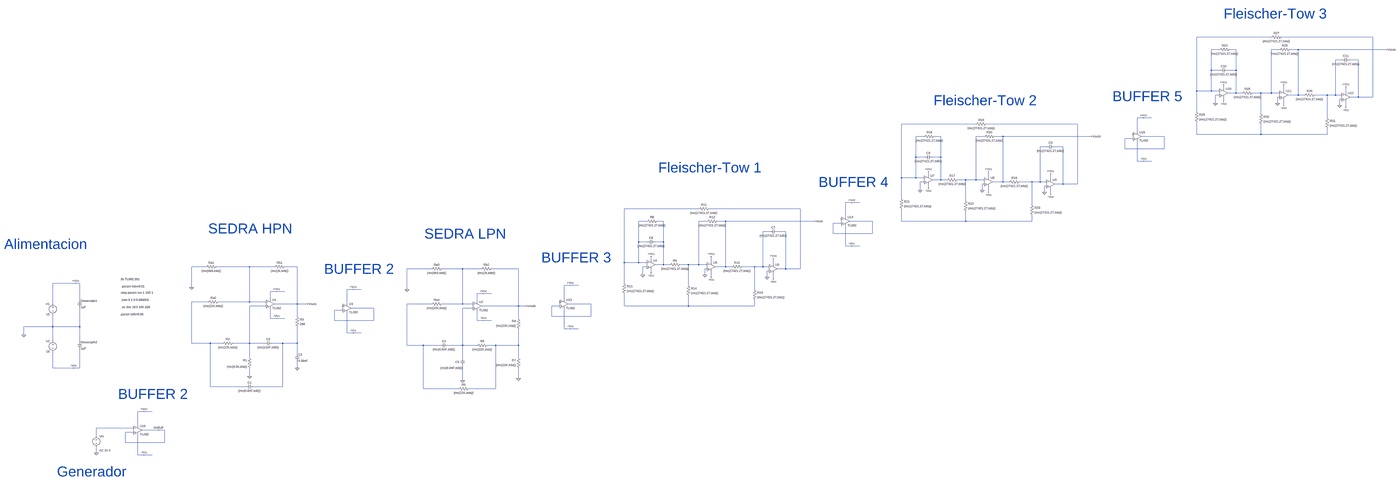
[diagram p0: schematic Filtro final.asc, whole sheet]
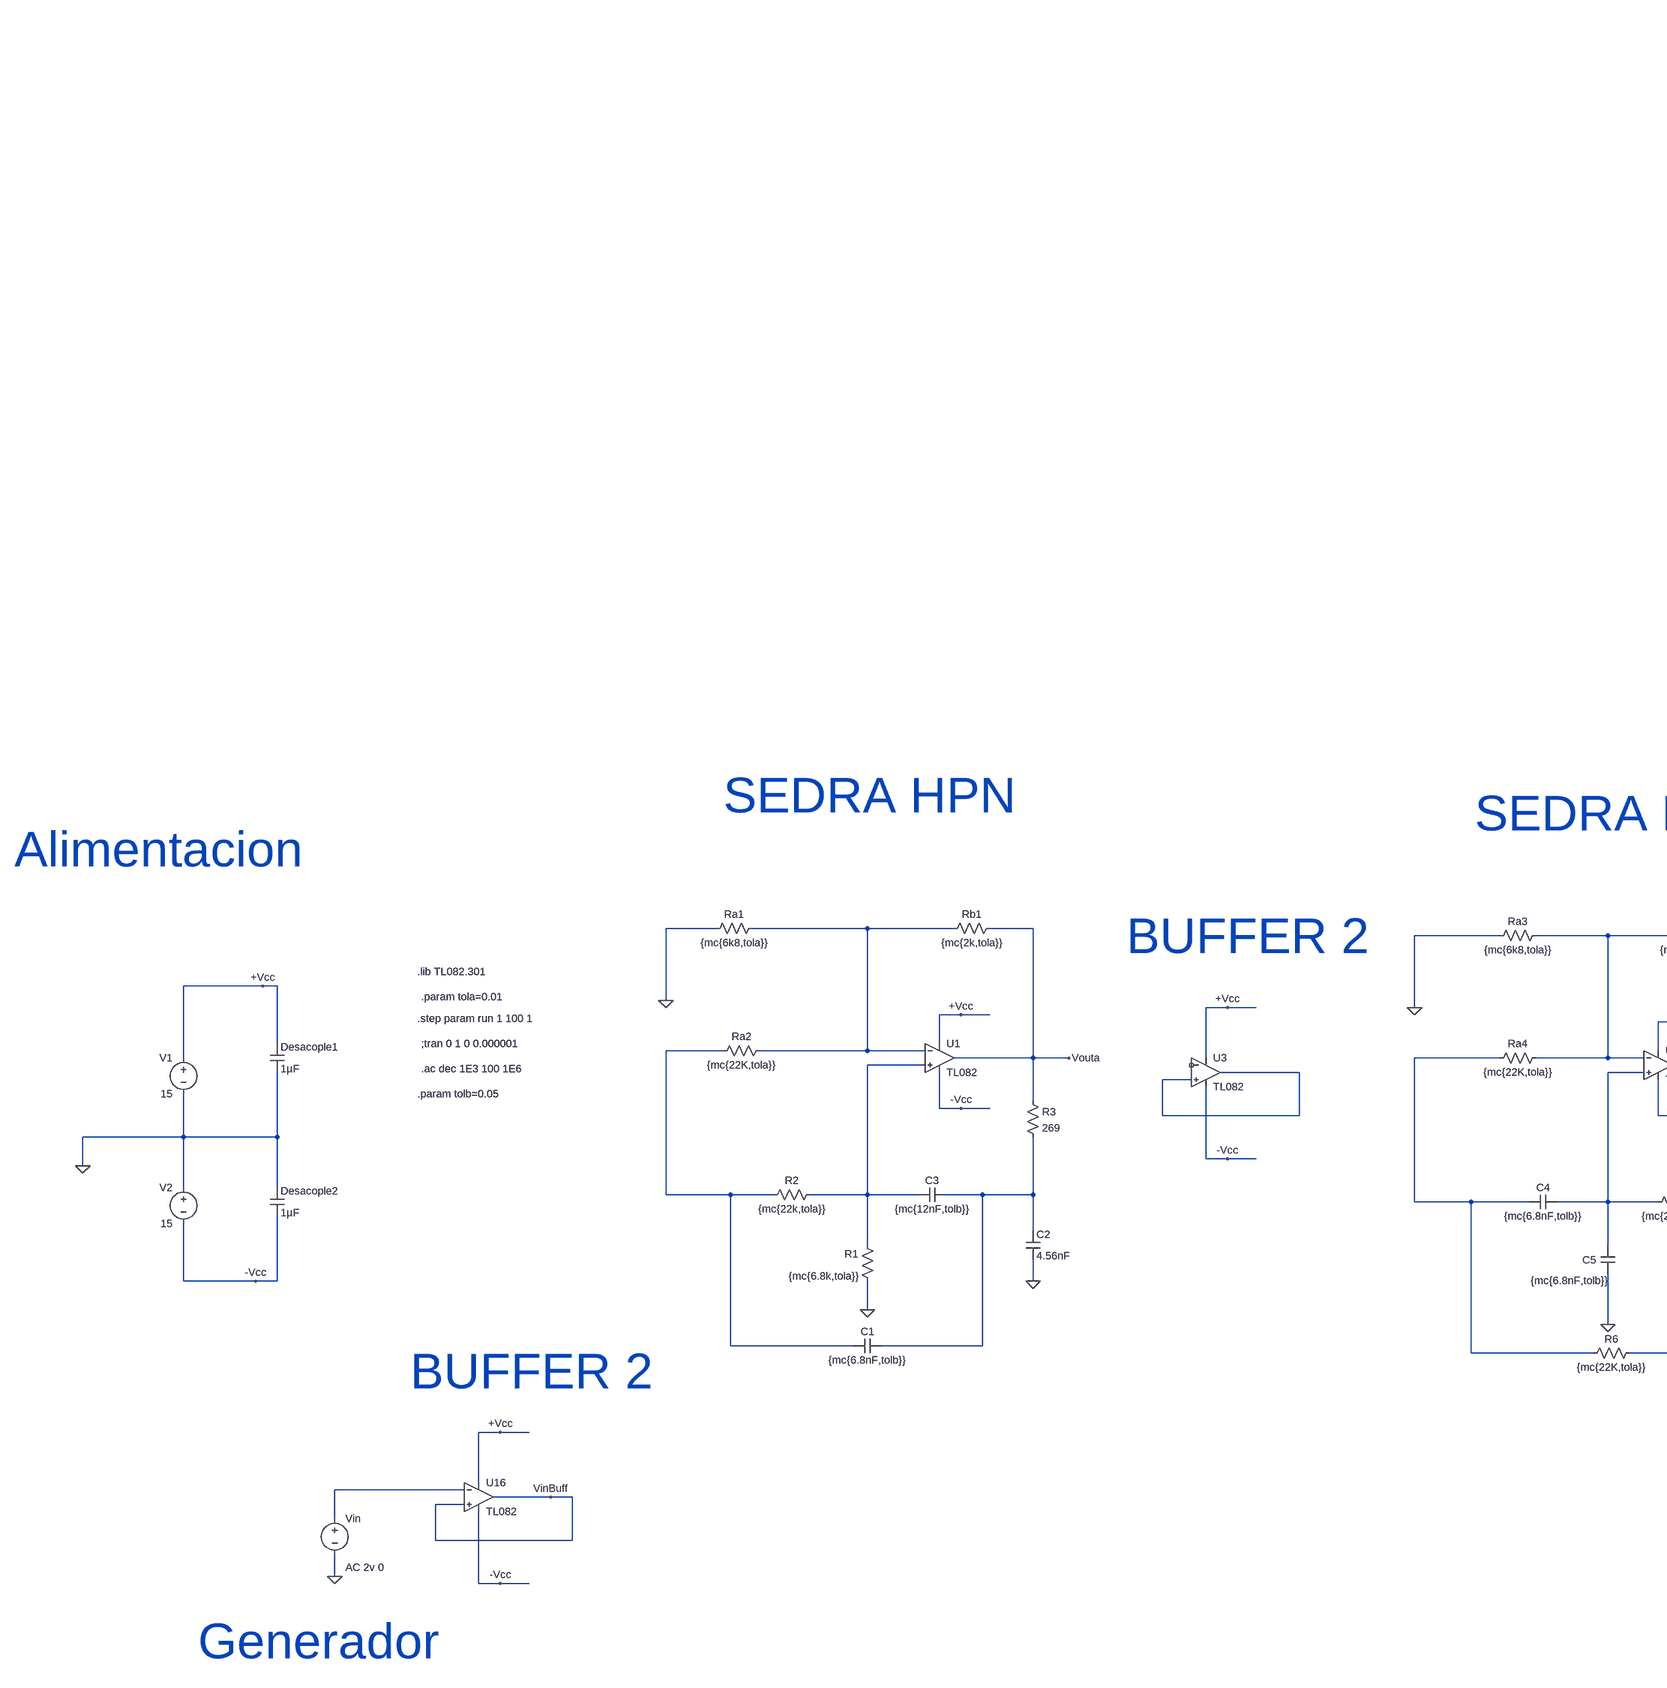
[diagram p1: schematic Filtro final.asc, part, row 1 of 1, column 1 of 3]
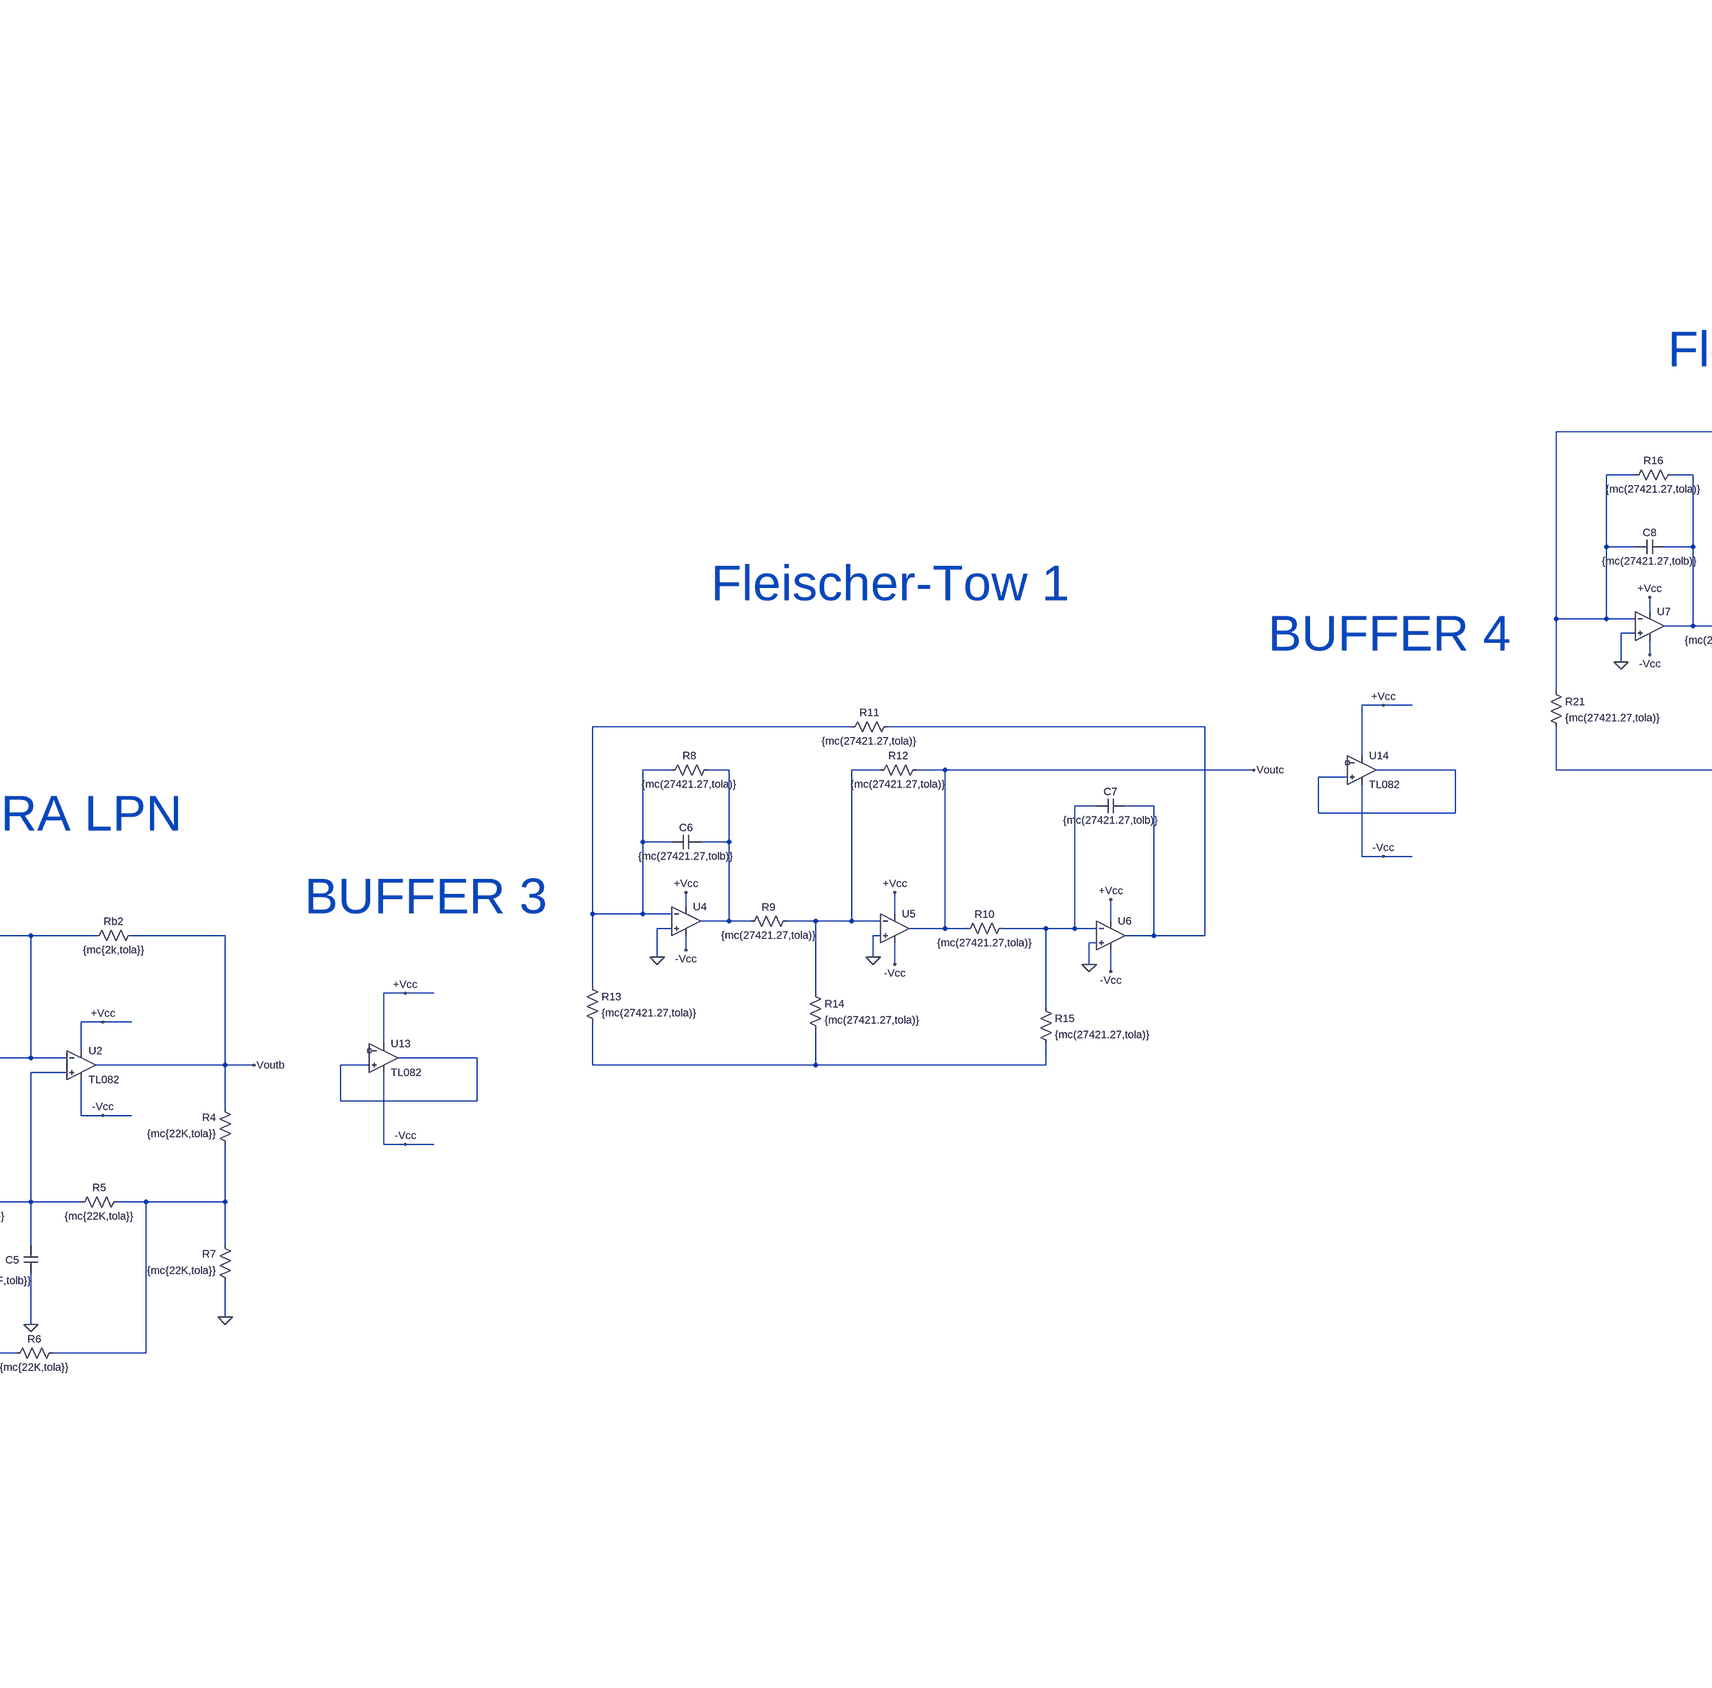
[diagram p2: schematic Filtro final.asc, part, row 1 of 1, column 2 of 3]
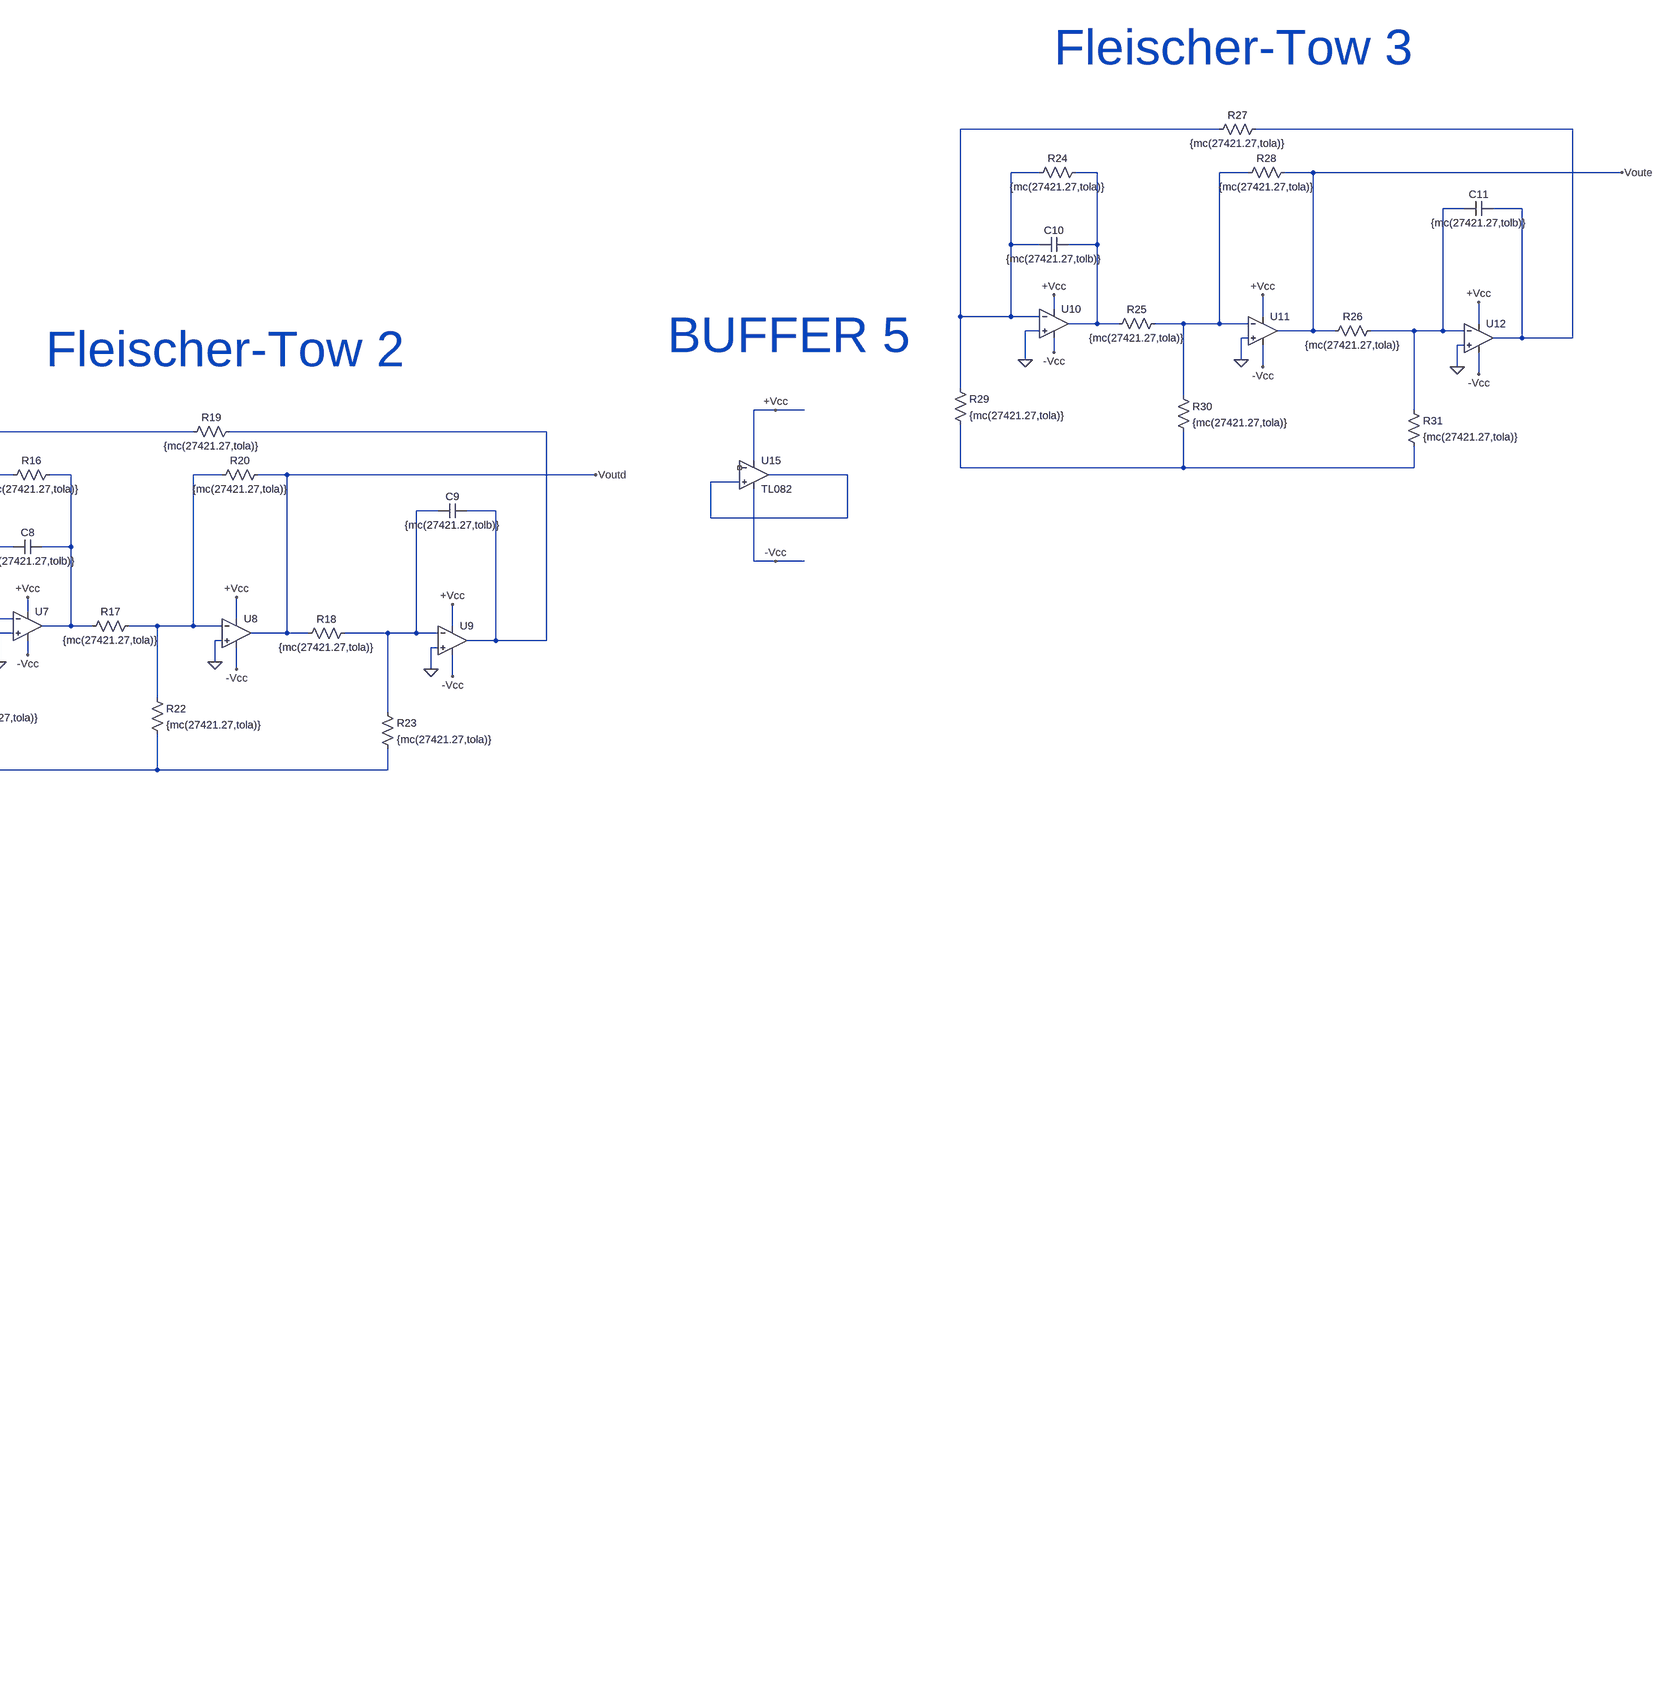
[diagram p3: schematic Filtro final.asc, part, row 1 of 1, column 3 of 3]
Filtro final.asc, the LTspice schematic file:
Version 4
SHEET 1 8028 680
WIRE 6992 -2832 6416 -2832
WIRE 7792 -2832 7072 -2832
WIRE 6592 -2736 6528 -2736
WIRE 6720 -2736 6672 -2736
WIRE 7056 -2736 6992 -2736
WIRE 7200 -2736 7136 -2736
WIRE 7936 -2736 7200 -2736
WIRE 7536 -2656 7488 -2656
WIRE 7664 -2656 7600 -2656
WIRE 6528 -2576 6528 -2736
WIRE 6592 -2576 6528 -2576
WIRE 6720 -2576 6720 -2736
WIRE 6720 -2576 6656 -2576
WIRE 6624 -2432 6624 -2464
WIRE 6416 -2416 6416 -2832
WIRE 6528 -2416 6528 -2576
WIRE 6528 -2416 6416 -2416
WIRE 6592 -2416 6528 -2416
WIRE 7088 -2416 7088 -2464
WIRE 6720 -2400 6720 -2576
WIRE 6720 -2400 6656 -2400
WIRE 6768 -2400 6720 -2400
WIRE 6912 -2400 6848 -2400
WIRE 6992 -2400 6992 -2736
WIRE 6992 -2400 6912 -2400
WIRE 7056 -2400 6992 -2400
WIRE 7568 -2400 7568 -2448
WIRE 6592 -2384 6560 -2384
WIRE 7200 -2384 7200 -2736
WIRE 7200 -2384 7120 -2384
WIRE 7248 -2384 7200 -2384
WIRE 7424 -2384 7328 -2384
WIRE 7488 -2384 7488 -2656
WIRE 7488 -2384 7424 -2384
WIRE 7536 -2384 7488 -2384
WIRE 7056 -2368 7040 -2368
WIRE 7664 -2368 7664 -2656
WIRE 7664 -2368 7600 -2368
WIRE 7792 -2368 7792 -2832
WIRE 7792 -2368 7664 -2368
WIRE 7536 -2352 7520 -2352
WIRE 6624 -2336 6624 -2368
WIRE 6560 -2320 6560 -2384
WIRE 7040 -2320 7040 -2368
WIRE 7088 -2304 7088 -2352
WIRE 7520 -2304 7520 -2352
WIRE 7568 -2288 7568 -2336
WIRE 6416 -2256 6416 -2416
WIRE 6912 -2240 6912 -2400
WIRE 5920 -2208 5872 -2208
WIRE 5984 -2208 5920 -2208
WIRE 7424 -2208 7424 -2384
WIRE 4576 -2160 4000 -2160
WIRE 5376 -2160 4656 -2160
WIRE 5872 -2096 5872 -2208
WIRE 6416 -2080 6416 -2176
WIRE 6912 -2080 6912 -2160
WIRE 6912 -2080 6416 -2080
WIRE 7424 -2080 7424 -2128
WIRE 7424 -2080 6912 -2080
WIRE 4176 -2064 4112 -2064
WIRE 4304 -2064 4256 -2064
WIRE 4640 -2064 4576 -2064
WIRE 4784 -2064 4720 -2064
WIRE 5520 -2064 4784 -2064
WIRE 6080 -2064 5904 -2064
WIRE 5840 -2048 5776 -2048
WIRE 5120 -1984 5072 -1984
WIRE 5248 -1984 5184 -1984
WIRE 5776 -1968 5776 -2048
WIRE 6080 -1968 6080 -2064
WIRE 6080 -1968 5776 -1968
WIRE 4112 -1904 4112 -2064
WIRE 4176 -1904 4112 -1904
WIRE 4304 -1904 4304 -2064
WIRE 4304 -1904 4240 -1904
WIRE 5872 -1872 5872 -2032
WIRE 5920 -1872 5872 -1872
WIRE 5984 -1872 5920 -1872
WIRE 4208 -1760 4208 -1792
WIRE 4000 -1744 4000 -2160
WIRE 4112 -1744 4112 -1904
WIRE 4112 -1744 4000 -1744
WIRE 4176 -1744 4112 -1744
WIRE 4672 -1744 4672 -1792
WIRE 4304 -1728 4304 -1904
WIRE 4304 -1728 4240 -1728
WIRE 4352 -1728 4304 -1728
WIRE 4496 -1728 4432 -1728
WIRE 4576 -1728 4576 -2064
WIRE 4576 -1728 4496 -1728
WIRE 4640 -1728 4576 -1728
WIRE 5152 -1728 5152 -1776
WIRE 4176 -1712 4144 -1712
WIRE 4784 -1712 4784 -2064
WIRE 4784 -1712 4704 -1712
WIRE 4832 -1712 4784 -1712
WIRE 5008 -1712 4912 -1712
WIRE 5072 -1712 5072 -1984
WIRE 5072 -1712 5008 -1712
WIRE 5120 -1712 5072 -1712
WIRE 4640 -1696 4624 -1696
WIRE 5248 -1696 5248 -1984
WIRE 5248 -1696 5184 -1696
WIRE 5376 -1696 5376 -2160
WIRE 5376 -1696 5248 -1696
WIRE 5120 -1680 5104 -1680
WIRE 4208 -1664 4208 -1696
WIRE 4144 -1648 4144 -1712
WIRE 4624 -1648 4624 -1696
WIRE 4672 -1632 4672 -1680
WIRE 5104 -1632 5104 -1680
WIRE 5152 -1616 5152 -1664
WIRE 4000 -1584 4000 -1744
WIRE 4496 -1568 4496 -1728
WIRE 3616 -1552 3568 -1552
WIRE 3680 -1552 3616 -1552
WIRE 5008 -1536 5008 -1712
WIRE 2384 -1504 1808 -1504
WIRE 3184 -1504 2464 -1504
WIRE 3568 -1440 3568 -1552
WIRE 1984 -1408 1920 -1408
WIRE 2112 -1408 2064 -1408
WIRE 2448 -1408 2384 -1408
WIRE 2592 -1408 2528 -1408
WIRE 3328 -1408 2592 -1408
WIRE 3776 -1408 3600 -1408
WIRE 4000 -1408 4000 -1504
WIRE 4496 -1408 4496 -1488
WIRE 4496 -1408 4000 -1408
WIRE 5008 -1408 5008 -1456
WIRE 5008 -1408 4496 -1408
WIRE 3536 -1392 3472 -1392
WIRE 2928 -1328 2880 -1328
WIRE 3056 -1328 2992 -1328
WIRE 3472 -1312 3472 -1392
WIRE 3776 -1312 3776 -1408
WIRE 3776 -1312 3472 -1312
WIRE 1920 -1248 1920 -1408
WIRE 1984 -1248 1920 -1248
WIRE 2112 -1248 2112 -1408
WIRE 2112 -1248 2048 -1248
WIRE 3568 -1216 3568 -1376
WIRE 3616 -1216 3568 -1216
WIRE 3680 -1216 3616 -1216
WIRE 2016 -1104 2016 -1136
WIRE 1808 -1088 1808 -1504
WIRE 1920 -1088 1920 -1248
WIRE 1920 -1088 1808 -1088
WIRE 1984 -1088 1920 -1088
WIRE 2480 -1088 2480 -1136
WIRE 2112 -1072 2112 -1248
WIRE 2112 -1072 2048 -1072
WIRE 2160 -1072 2112 -1072
WIRE 2304 -1072 2240 -1072
WIRE 2384 -1072 2384 -1408
WIRE 2384 -1072 2304 -1072
WIRE 2448 -1072 2384 -1072
WIRE 2960 -1072 2960 -1120
WIRE -1440 -1056 -1552 -1056
WIRE -1104 -1056 -1360 -1056
WIRE -912 -1056 -1104 -1056
WIRE -736 -1056 -832 -1056
WIRE 1984 -1056 1952 -1056
WIRE 2592 -1056 2592 -1408
WIRE 2592 -1056 2512 -1056
WIRE 2640 -1056 2592 -1056
WIRE 2816 -1056 2720 -1056
WIRE 2880 -1056 2880 -1328
WIRE 2880 -1056 2816 -1056
WIRE 2928 -1056 2880 -1056
WIRE 320 -1040 112 -1040
WIRE 560 -1040 400 -1040
WIRE 704 -1040 560 -1040
WIRE 992 -1040 784 -1040
WIRE 2448 -1040 2432 -1040
WIRE 3056 -1040 3056 -1328
WIRE 3056 -1040 2992 -1040
WIRE 3184 -1040 3184 -1504
WIRE 3184 -1040 3056 -1040
WIRE 2928 -1024 2912 -1024
WIRE 2016 -1008 2016 -1040
WIRE 1952 -992 1952 -1056
WIRE 2432 -992 2432 -1040
WIRE 2480 -976 2480 -1024
WIRE 2912 -976 2912 -1024
WIRE 2960 -960 2960 -1008
WIRE -2448 -928 -2624 -928
WIRE -2416 -928 -2448 -928
WIRE 1808 -928 1808 -1088
WIRE 1392 -912 1344 -912
WIRE 1456 -912 1392 -912
WIRE 2304 -912 2304 -1072
WIRE -1552 -896 -1552 -1056
WIRE -304 -880 -352 -880
WIRE -240 -880 -304 -880
WIRE 112 -880 112 -1040
WIRE 2816 -880 2816 -1056
WIRE -896 -864 -944 -864
WIRE -832 -864 -896 -864
WIRE 720 -848 672 -848
WIRE 784 -848 720 -848
WIRE -2416 -800 -2416 -928
WIRE -944 -800 -944 -864
WIRE 1344 -800 1344 -912
WIRE -1424 -784 -1552 -784
WIRE -1104 -784 -1104 -1056
WIRE -1104 -784 -1344 -784
WIRE -976 -784 -1104 -784
WIRE 672 -784 672 -848
WIRE -2624 -768 -2624 -928
WIRE -736 -768 -736 -1056
WIRE -736 -768 -912 -768
WIRE -656 -768 -736 -768
WIRE -352 -768 -352 -880
WIRE 320 -768 112 -768
WIRE 560 -768 560 -1040
WIRE 560 -768 400 -768
WIRE 640 -768 560 -768
WIRE 1552 -768 1376 -768
WIRE -976 -752 -1104 -752
WIRE 992 -752 992 -1040
WIRE 992 -752 704 -752
WIRE 1056 -752 992 -752
WIRE 1312 -752 1248 -752
WIRE 1808 -752 1808 -848
WIRE 2304 -752 2304 -832
WIRE 2304 -752 1808 -752
WIRE 2816 -752 2816 -800
WIRE 2816 -752 2304 -752
WIRE -144 -736 -320 -736
WIRE 640 -736 560 -736
WIRE -384 -720 -448 -720
WIRE -736 -672 -736 -768
WIRE 1248 -672 1248 -752
WIRE 1552 -672 1552 -768
WIRE 1552 -672 1248 -672
WIRE -944 -656 -944 -736
WIRE -896 -656 -944 -656
WIRE -832 -656 -896 -656
WIRE 992 -656 992 -752
WIRE -448 -640 -448 -720
WIRE -144 -640 -144 -736
WIRE -144 -640 -448 -640
WIRE 672 -640 672 -720
WIRE 720 -640 672 -640
WIRE 784 -640 720 -640
WIRE -2624 -592 -2624 -688
WIRE -2624 -592 -2848 -592
WIRE -2416 -592 -2416 -736
WIRE -2416 -592 -2624 -592
WIRE 1344 -576 1344 -736
WIRE 1392 -576 1344 -576
WIRE 1456 -576 1392 -576
WIRE -352 -544 -352 -704
WIRE -304 -544 -352 -544
WIRE -240 -544 -304 -544
WIRE -2848 -528 -2848 -592
WIRE -2624 -480 -2624 -592
WIRE -2416 -480 -2416 -592
WIRE -1552 -464 -1552 -784
WIRE -1408 -464 -1552 -464
WIRE -1312 -464 -1408 -464
WIRE -1104 -464 -1104 -752
WIRE -1104 -464 -1232 -464
WIRE -992 -464 -1104 -464
WIRE -848 -464 -928 -464
WIRE -736 -464 -736 -592
WIRE -736 -464 -848 -464
WIRE 112 -448 112 -768
WIRE 256 -448 112 -448
WIRE 384 -448 256 -448
WIRE 560 -448 560 -736
WIRE 560 -448 448 -448
WIRE 672 -448 560 -448
WIRE 816 -448 752 -448
WIRE 992 -448 992 -576
WIRE 992 -448 816 -448
WIRE -736 -384 -736 -464
WIRE -1104 -352 -1104 -464
WIRE 560 -352 560 -448
WIRE 992 -352 992 -448
WIRE -2624 -272 -2624 -400
WIRE -2464 -272 -2624 -272
WIRE -2416 -272 -2416 -416
WIRE -2416 -272 -2464 -272
WIRE -736 -272 -736 -320
WIRE -1104 -208 -1104 -272
WIRE 992 -192 992 -272
WIRE 560 -176 560 -288
WIRE -1408 -128 -1408 -464
WIRE -1136 -128 -1408 -128
WIRE -848 -128 -848 -464
WIRE -848 -128 -1072 -128
WIRE 256 -112 256 -448
WIRE 528 -112 256 -112
WIRE 816 -112 816 -448
WIRE 816 -112 608 -112
WIRE -1920 64 -1968 64
WIRE -1856 64 -1920 64
WIRE -1968 176 -1968 64
WIRE -2000 192 -2288 192
WIRE -1808 208 -1936 208
WIRE -1760 208 -1808 208
WIRE -2000 224 -2064 224
WIRE -2288 256 -2288 192
WIRE -2064 304 -2064 224
WIRE -1760 304 -1760 208
WIRE -1760 304 -2064 304
WIRE -2288 384 -2288 336
WIRE -1968 400 -1968 240
WIRE -1920 400 -1968 400
WIRE -1856 400 -1920 400
FLAG -2848 -528 0
FLAG -2448 -928 +Vcc
FLAG -2464 -272 -Vcc
FLAG -1552 -896 0
FLAG -896 -864 +Vcc
FLAG -896 -656 -Vcc
FLAG -2288 384 0
FLAG -1104 -208 0
FLAG -656 -768 Vouta
FLAG -736 -272 0
FLAG 112 -880 0
FLAG 720 -848 +Vcc
FLAG 720 -640 -Vcc
FLAG 560 -176 0
FLAG 1056 -752 Voutb
FLAG 992 -192 0
FLAG -304 -880 +Vcc
FLAG -304 -544 -Vcc
FLAG 2912 -976 0
FLAG 2432 -992 0
FLAG 3328 -1408 Voutc
FLAG 2016 -1136 +Vcc
FLAG 2480 -1136 +Vcc
FLAG 2960 -1120 +Vcc
FLAG 2016 -1008 -Vcc
FLAG 2480 -976 -Vcc
FLAG 2960 -960 -Vcc
FLAG 1952 -992 0
FLAG 5104 -1632 0
FLAG 4624 -1648 0
FLAG 5520 -2064 Voutd
FLAG 4208 -1792 +Vcc
FLAG 4672 -1792 +Vcc
FLAG 5152 -1776 +Vcc
FLAG 4208 -1664 -Vcc
FLAG 4672 -1632 -Vcc
FLAG 5152 -1616 -Vcc
FLAG 4144 -1648 0
FLAG 7520 -2304 0
FLAG 7040 -2320 0
FLAG 7936 -2736 Voute
FLAG 6624 -2464 +Vcc
FLAG 7088 -2464 +Vcc
FLAG 7568 -2448 +Vcc
FLAG 6624 -2336 -Vcc
FLAG 7088 -2304 -Vcc
FLAG 7568 -2288 -Vcc
FLAG 6560 -2320 0
FLAG 1392 -912 +Vcc
FLAG 1392 -576 -Vcc
FLAG 3616 -1552 +Vcc
FLAG 3616 -1216 -Vcc
FLAG 5920 -2208 +Vcc
FLAG 5920 -1872 -Vcc
FLAG -1920 64 +Vcc
FLAG -1920 400 -Vcc
FLAG -1808 208 VinBuff
SYMBOL voltage -2624 -784 M0
WINDOW 123 0 0 Left 2
WINDOW 39 0 0 Left 2
SYMATTR InstName V1
SYMATTR Value 15
SYMBOL voltage -2624 -496 M0
WINDOW 123 0 0 Left 2
WINDOW 39 0 0 Left 2
SYMATTR InstName V2
SYMATTR Value 15
SYMBOL res -1344 -1072 R90
WINDOW 0 0 56 VBottom 2
WINDOW 3 32 56 VTop 2
SYMATTR InstName Ra1
SYMATTR Value {mc{6k8,tola}}
SYMBOL res -816 -1072 R90
WINDOW 0 0 56 VBottom 2
WINDOW 3 32 56 VTop 2
SYMATTR InstName Rb1
SYMATTR Value {mc{2k,tola}}
SYMBOL res -1088 -256 R180
WINDOW 0 36 76 Left 2
WINDOW 3 191 27 Right 2
SYMATTR InstName R1
SYMATTR Value {mc{6.8k,tola}}
SYMBOL Opamps\\opamp2 -944 -832 R0
SYMATTR InstName U1
SYMATTR Value TL082
SYMBOL res -1216 -480 R90
WINDOW 0 0 56 VBottom 2
WINDOW 3 32 56 VTop 2
SYMATTR InstName R2
SYMATTR Value {mc{22k,tola}}
SYMBOL voltage -2288 240 R0
WINDOW 123 24 124 Left 2
WINDOW 39 0 0 Left 2
WINDOW 3 24 152 Left 2
SYMATTR Value2 AC 2v 0
SYMATTR Value ""
SYMATTR InstName Vin
SYMBOL res -752 -688 R0
SYMATTR InstName R3
SYMATTR Value 269
SYMBOL cap -1072 -144 R90
WINDOW 0 0 32 VBottom 2
WINDOW 3 32 32 VTop 2
SYMATTR InstName C1
SYMATTR Value {mc{6.8nF,tolb}}
SYMBOL res -1328 -800 R90
WINDOW 0 0 56 VBottom 2
WINDOW 3 32 56 VTop 2
SYMATTR InstName Ra2
SYMATTR Value {mc{22K,tola}}
SYMBOL cap -752 -384 R0
SYMATTR InstName C2
SYMATTR Value 4.56nF
SYMBOL cap -928 -480 R90
WINDOW 0 0 32 VBottom 2
WINDOW 3 32 32 VTop 2
SYMATTR InstName C3
SYMATTR Value {mc{12nF,tolb}}
SYMBOL cap -2432 -800 R0
SYMATTR InstName Desacople1
SYMATTR Value 1µF
SYMBOL cap -2432 -480 R0
SYMATTR InstName Desacople2
SYMATTR Value 1µF
SYMBOL res 416 -1056 R90
WINDOW 0 0 56 VBottom 2
WINDOW 3 32 56 VTop 2
SYMATTR InstName Ra3
SYMATTR Value {mc{6k8,tola}}
SYMBOL res 800 -1056 R90
WINDOW 0 0 56 VBottom 2
WINDOW 3 32 56 VTop 2
SYMATTR InstName Rb2
SYMATTR Value {mc{2k,tola}}
SYMBOL Opamps\\opamp2 672 -816 R0
SYMATTR InstName U2
SYMATTR Value TL082
SYMBOL cap 448 -464 R90
WINDOW 0 0 32 VBottom 2
WINDOW 3 32 32 VTop 2
SYMATTR InstName C4
SYMATTR Value {mc{6.8nF,tolb}}
SYMBOL res 416 -784 R90
WINDOW 0 0 56 VBottom 2
WINDOW 3 32 56 VTop 2
SYMATTR InstName Ra4
SYMATTR Value {mc{22K,tola}}
SYMBOL cap 576 -288 R180
WINDOW 0 42 31 Left 2
WINDOW 3 188 -15 Right 2
SYMATTR InstName C5
SYMATTR Value {mc{6.8nF,tolb}}
SYMBOL res 1008 -560 R180
WINDOW 0 36 76 Left 2
WINDOW 3 36 40 Left 2
SYMATTR InstName R4
SYMATTR Value {mc{22K,tola}}
SYMBOL res 656 -432 R270
WINDOW 0 32 56 VTop 2
WINDOW 3 0 56 VBottom 2
SYMATTR InstName R5
SYMATTR Value {mc{22K,tola}}
SYMBOL res 512 -96 R270
WINDOW 0 32 56 VTop 2
WINDOW 3 0 56 VBottom 2
SYMATTR InstName R6
SYMATTR Value {mc{22K,tola}}
SYMBOL res 1008 -256 R180
WINDOW 0 36 76 Left 2
WINDOW 3 36 40 Left 2
SYMATTR InstName R7
SYMATTR Value {mc{22K,tola}}
SYMBOL Opamps\\opamp2 -352 -800 R0
SYMATTR InstName U3
SYMATTR Value TL082
SYMBOL Opamps\\UniversalOpamp2 2016 -1072 R0
SYMATTR InstName U4
SYMATTR Value2 Avol=1000Meg GBW=10000Meg Slew=1000Meg
SYMATTR SpiceLine ilimit=50 rail=0 Vos=0 phimargin=45
SYMATTR SpiceLine2 en=0 enk=0 in=0 ink=0 Rin=100000Meg
SYMBOL Opamps\\UniversalOpamp2 2480 -1056 R0
SYMATTR InstName U5
SYMATTR Value2 Avol=1000Meg GBW=10000Meg Slew=1000Meg
SYMATTR SpiceLine ilimit=50 rail=0 Vos=0 phimargin=45
SYMATTR SpiceLine2 en=0 enk=0 in=0 ink=0 Rin=100000Meg
SYMBOL Opamps\\UniversalOpamp2 2960 -1040 R0
SYMATTR InstName U6
SYMATTR Value2 Avol=1000Meg GBW=10000Meg Slew=1000Meg
SYMATTR SpiceLine ilimit=50 rail=0 Vos=0 phimargin=45
SYMATTR SpiceLine2 en=0 enk=0 in=0 ink=0 Rin=100000Meg
SYMBOL res 2080 -1424 R90
WINDOW 0 0 56 VBottom 2
WINDOW 3 32 56 VTop 2
SYMATTR InstName R8
SYMATTR Value {mc(27421.27,tola)}
SYMBOL res 2256 -1088 R90
WINDOW 0 0 56 VBottom 2
WINDOW 3 32 56 VTop 2
SYMATTR InstName R9
SYMATTR Value {mc(27421.27,tola)}
SYMBOL res 2736 -1072 R90
WINDOW 0 0 56 VBottom 2
WINDOW 3 32 56 VTop 2
SYMATTR InstName R10
SYMATTR Value {mc(27421.27,tola)}
SYMBOL cap 2048 -1264 R90
WINDOW 0 0 32 VBottom 2
WINDOW 3 32 32 VTop 2
SYMATTR InstName C6
SYMATTR Value {mc(27421.27,tolb)}
SYMBOL res 2480 -1520 R90
WINDOW 0 0 56 VBottom 2
WINDOW 3 32 56 VTop 2
SYMATTR InstName R11
SYMATTR Value {mc(27421.27,tola)}
SYMBOL res 2544 -1424 R90
WINDOW 0 0 56 VBottom 2
WINDOW 3 32 56 VTop 2
SYMATTR InstName R12
SYMATTR Value {mc(27421.27,tola)}
SYMBOL cap 2992 -1344 R90
WINDOW 0 0 32 VBottom 2
WINDOW 3 32 32 VTop 2
SYMATTR InstName C7
SYMATTR Value {mc(27421.27,tolb)}
SYMBOL res 1792 -944 R0
SYMATTR InstName R13
SYMATTR Value {mc(27421.27,tola)}
SYMBOL res 2288 -928 R0
SYMATTR InstName R14
SYMATTR Value {mc(27421.27,tola)}
SYMBOL res 2800 -896 R0
SYMATTR InstName R15
SYMATTR Value {mc(27421.27,tola)}
SYMBOL Opamps\\UniversalOpamp2 4208 -1728 R0
SYMATTR InstName U7
SYMATTR Value2 Avol=1000Meg GBW=10000Meg Slew=1000Meg
SYMATTR SpiceLine ilimit=50 rail=0 Vos=0 phimargin=45
SYMATTR SpiceLine2 en=0 enk=0 in=0 ink=0 Rin=100000Meg
SYMBOL Opamps\\UniversalOpamp2 4672 -1712 R0
SYMATTR InstName U8
SYMATTR Value2 Avol=1000Meg GBW=10000Meg Slew=1000Meg
SYMATTR SpiceLine ilimit=50 rail=0 Vos=0 phimargin=45
SYMATTR SpiceLine2 en=0 enk=0 in=0 ink=0 Rin=100000Meg
SYMBOL Opamps\\UniversalOpamp2 5152 -1696 R0
SYMATTR InstName U9
SYMATTR Value2 Avol=1000Meg GBW=10000Meg Slew=1000Meg
SYMATTR SpiceLine ilimit=50 rail=0 Vos=0 phimargin=45
SYMATTR SpiceLine2 en=0 enk=0 in=0 ink=0 Rin=100000Meg
SYMBOL res 4272 -2080 R90
WINDOW 0 0 56 VBottom 2
WINDOW 3 32 56 VTop 2
SYMATTR InstName R16
SYMATTR Value {mc(27421.27,tola)}
SYMBOL res 4448 -1744 R90
WINDOW 0 0 56 VBottom 2
WINDOW 3 32 56 VTop 2
SYMATTR InstName R17
SYMATTR Value {mc(27421.27,tola)}
SYMBOL res 4928 -1728 R90
WINDOW 0 0 56 VBottom 2
WINDOW 3 32 56 VTop 2
SYMATTR InstName R18
SYMATTR Value {mc(27421.27,tola)}
SYMBOL cap 4240 -1920 R90
WINDOW 0 0 32 VBottom 2
WINDOW 3 32 32 VTop 2
SYMATTR InstName C8
SYMATTR Value {mc(27421.27,tolb)}
SYMBOL res 4672 -2176 R90
WINDOW 0 0 56 VBottom 2
WINDOW 3 32 56 VTop 2
SYMATTR InstName R19
SYMATTR Value {mc(27421.27,tola)}
SYMBOL res 4736 -2080 R90
WINDOW 0 0 56 VBottom 2
WINDOW 3 32 56 VTop 2
SYMATTR InstName R20
SYMATTR Value {mc(27421.27,tola)}
SYMBOL cap 5184 -2000 R90
WINDOW 0 0 32 VBottom 2
WINDOW 3 32 32 VTop 2
SYMATTR InstName C9
SYMATTR Value {mc(27421.27,tolb)}
SYMBOL res 3984 -1600 R0
SYMATTR InstName R21
SYMATTR Value {mc(27421.27,tola)}
SYMBOL res 4480 -1584 R0
SYMATTR InstName R22
SYMATTR Value {mc(27421.27,tola)}
SYMBOL res 4992 -1552 R0
SYMATTR InstName R23
SYMATTR Value {mc(27421.27,tola)}
SYMBOL Opamps\\UniversalOpamp2 6624 -2400 R0
SYMATTR InstName U10
SYMATTR Value2 Avol=1000Meg GBW=10000Meg Slew=1000Meg
SYMATTR SpiceLine ilimit=50 rail=0 Vos=0 phimargin=45
SYMATTR SpiceLine2 en=0 enk=0 in=0 ink=0 Rin=100000Meg
SYMBOL Opamps\\UniversalOpamp2 7088 -2384 R0
SYMATTR InstName U11
SYMATTR Value2 Avol=1000Meg GBW=10000Meg Slew=1000Meg
SYMATTR SpiceLine ilimit=50 rail=0 Vos=0 phimargin=45
SYMATTR SpiceLine2 en=0 enk=0 in=0 ink=0 Rin=100000Meg
SYMBOL Opamps\\UniversalOpamp2 7568 -2368 R0
SYMATTR InstName U12
SYMATTR Value2 Avol=1000Meg GBW=10000Meg Slew=1000Meg
SYMATTR SpiceLine ilimit=50 rail=0 Vos=0 phimargin=45
SYMATTR SpiceLine2 en=0 enk=0 in=0 ink=0 Rin=100000Meg
SYMBOL res 6688 -2752 R90
WINDOW 0 0 56 VBottom 2
WINDOW 3 32 56 VTop 2
SYMATTR InstName R24
SYMATTR Value {mc(27421.27,tola)}
SYMBOL res 6864 -2416 R90
WINDOW 0 0 56 VBottom 2
WINDOW 3 32 56 VTop 2
SYMATTR InstName R25
SYMATTR Value {mc(27421.27,tola)}
SYMBOL res 7344 -2400 R90
WINDOW 0 0 56 VBottom 2
WINDOW 3 32 56 VTop 2
SYMATTR InstName R26
SYMATTR Value {mc(27421.27,tola)}
SYMBOL cap 6656 -2592 R90
WINDOW 0 0 32 VBottom 2
WINDOW 3 32 32 VTop 2
SYMATTR InstName C10
SYMATTR Value {mc(27421.27,tolb)}
SYMBOL res 7088 -2848 R90
WINDOW 0 0 56 VBottom 2
WINDOW 3 32 56 VTop 2
SYMATTR InstName R27
SYMATTR Value {mc(27421.27,tola)}
SYMBOL res 7152 -2752 R90
WINDOW 0 0 56 VBottom 2
WINDOW 3 32 56 VTop 2
SYMATTR InstName R28
SYMATTR Value {mc(27421.27,tola)}
SYMBOL cap 7600 -2672 R90
WINDOW 0 0 32 VBottom 2
WINDOW 3 32 32 VTop 2
SYMATTR InstName C11
SYMATTR Value {mc(27421.27,tolb)}
SYMBOL res 6400 -2272 R0
SYMATTR InstName R29
SYMATTR Value {mc(27421.27,tola)}
SYMBOL res 6896 -2256 R0
SYMATTR InstName R30
SYMATTR Value {mc(27421.27,tola)}
SYMBOL res 7408 -2224 R0
SYMATTR InstName R31
SYMATTR Value {mc(27421.27,tola)}
SYMBOL Opamps\\opamp2 1344 -832 R0
SYMATTR InstName U13
SYMATTR Value TL082
SYMBOL Opamps\\opamp2 3568 -1472 R0
SYMATTR InstName U14
SYMATTR Value TL082
SYMBOL Opamps\\opamp2 5872 -2128 R0
SYMATTR InstName U15
SYMATTR Value TL082
SYMBOL Opamps\\opamp2 -1968 144 R0
SYMATTR InstName U16
SYMATTR Value TL082
TEXT -2104 -960 Left 2 !.lib TL082.301
TEXT -2096 -744 Left 2 !.ac dec 1E3 100 1E6
TEXT -2096 -904 Left 2 !.param tola=0.01
TEXT -2104 -856 Left 2 !.step param run 1 100 1
TEXT -2096 -800 Left 2 !;tran 0 1 0 0.000001
TEXT -2104 -688 Left 2 !.param tolb=0.05
TEXT -1424 -1352 Left 7 ;SEDRA HPN
TEXT 264 -1312 Left 7 ;SEDRA LPN
TEXT 2072 -1824 Left 7 ;Fleischer-Tow 1
TEXT 4248 -2344 Left 7 ;Fleischer-Tow 2
TEXT 6624 -3088 Left 7 ;Fleischer-Tow 3
TEXT -528 -1040 Left 7 ;BUFFER 2
TEXT 1168 -1128 Left 7 ;BUFFER 3
TEXT 3360 -1712 Left 7 ;BUFFER 4
TEXT 5680 -2376 Left 7 ;BUFFER 5
TEXT -2120 -72 Left 7 ;BUFFER 2
TEXT -2592 528 Left 7 ;Generador
TEXT -3000 -1232 Left 7 ;Alimentacion

The netlist it stands for:
* Filtro final.asc
V1 +Vcc 0 15
V2 0 -Vcc 15
Ra1 N020 0 {mc{6k8,tola}}
Rb1 Vouta N020 {mc{2k,tola}}
R1 0 N025 {mc{6.8k,tola}}
XU1 N025 N020 +Vcc -Vcc Vouta TL082  ; pins In+ In- V+ V- OUT
R2 N025 N022 {mc{22k,tola}}
Vin N031 0 AC 2v 0
R3 Vouta N029 269
C1 N029 N022 {mc{6.8nF,tolb}}
Ra2 N020 N022 {mc{22K,tola}}
C2 N029 0 4.56nF
C3 N029 N025 {mc{12nF,tolb}}
C§Desacople1 +Vcc 0 1µF
C§Desacople2 0 -Vcc 1µF
Ra3 N021 0 {mc{6k8,tola}}
Rb2 Voutb N021 {mc{2k,tola}}
XU2 N028 N021 +Vcc -Vcc Voutb TL082  ; pins In+ In- V+ V- OUT
C4 N028 N023 {mc{6.8nF,tolb}}
Ra4 N021 N023 {mc{22K,tola}}
C5 0 N028 {mc{6.8nF,tolb}}
R4 N030 Voutb {mc{22K,tola}}
R5 N028 N030 {mc{22K,tola}}
R6 N023 N030 {mc{22K,tola}}
R7 0 N030 {mc{22K,tola}}
XU3 N027 NC_01 +Vcc -Vcc N027 TL082  ; pins In+ In- V+ V- OUT
XU4 0 N013 +Vcc -Vcc N015 level.2 Avol=1000Meg GBW=10000Meg Slew=1000Meg ilimit=50 rail=0 Vos=0 phimargin=45 en=0 enk=0 in=0 ink=0 Rin=100000Meg  ; pins IN+ IN- V+ V- OUT
XU5 0 N016 +Vcc -Vcc Voutc level.2 Avol=1000Meg GBW=10000Meg Slew=1000Meg ilimit=50 rail=0 Vos=0 phimargin=45 en=0 enk=0 in=0 ink=0 Rin=100000Meg  ; pins IN+ IN- V+ V- OUT
XU6 0 N019 +Vcc -Vcc N014 level.2 Avol=1000Meg GBW=10000Meg Slew=1000Meg ilimit=50 rail=0 Vos=0 phimargin=45 en=0 enk=0 in=0 ink=0 Rin=100000Meg  ; pins IN+ IN- V+ V- OUT
R8 N015 N013 {mc(27421.27,tola)}
R9 N016 N015 {mc(27421.27,tola)}
R10 N019 Voutc {mc(27421.27,tola)}
C6 N015 N013 {mc(27421.27,tolb)}
R11 N014 N013 {mc(27421.27,tola)}
R12 Voutc N016 {mc(27421.27,tola)}
C7 N014 N019 {mc(27421.27,tolb)}
R13 N013 N026 {mc(27421.27,tola)}
R14 N016 N026 {mc(27421.27,tola)}
R15 N019 N026 {mc(27421.27,tola)}
XU7 0 N006 +Vcc -Vcc N009 level.2 Avol=1000Meg GBW=10000Meg Slew=1000Meg ilimit=50 rail=0 Vos=0 phimargin=45 en=0 enk=0 in=0 ink=0 Rin=100000Meg  ; pins IN+ IN- V+ V- OUT
XU8 0 N010 +Vcc -Vcc Voutd level.2 Avol=1000Meg GBW=10000Meg Slew=1000Meg ilimit=50 rail=0 Vos=0 phimargin=45 en=0 enk=0 in=0 ink=0 Rin=100000Meg  ; pins IN+ IN- V+ V- OUT
XU9 0 N012 +Vcc -Vcc N007 level.2 Avol=1000Meg GBW=10000Meg Slew=1000Meg ilimit=50 rail=0 Vos=0 phimargin=45 en=0 enk=0 in=0 ink=0 Rin=100000Meg  ; pins IN+ IN- V+ V- OUT
R16 N009 N006 {mc(27421.27,tola)}
R17 N010 N009 {mc(27421.27,tola)}
R18 N012 Voutd {mc(27421.27,tola)}
C8 N009 N006 {mc(27421.27,tolb)}
R19 N007 N006 {mc(27421.27,tola)}
R20 Voutd N010 {mc(27421.27,tola)}
C9 N007 N012 {mc(27421.27,tolb)}
R21 N006 N018 {mc(27421.27,tola)}
R22 N010 N018 {mc(27421.27,tola)}
R23 N012 N018 {mc(27421.27,tola)}
XU10 0 N001 +Vcc -Vcc N003 level.2 Avol=1000Meg GBW=10000Meg Slew=1000Meg ilimit=50 rail=0 Vos=0 phimargin=45 en=0 enk=0 in=0 ink=0 Rin=100000Meg  ; pins IN+ IN- V+ V- OUT
XU11 0 N004 +Vcc -Vcc Voute level.2 Avol=1000Meg GBW=10000Meg Slew=1000Meg ilimit=50 rail=0 Vos=0 phimargin=45 en=0 enk=0 in=0 ink=0 Rin=100000Meg  ; pins IN+ IN- V+ V- OUT
XU12 0 N005 +Vcc -Vcc N002 level.2 Avol=1000Meg GBW=10000Meg Slew=1000Meg ilimit=50 rail=0 Vos=0 phimargin=45 en=0 enk=0 in=0 ink=0 Rin=100000Meg  ; pins IN+ IN- V+ V- OUT
R24 N003 N001 {mc(27421.27,tola)}
R25 N004 N003 {mc(27421.27,tola)}
R26 N005 Voute {mc(27421.27,tola)}
C10 N003 N001 {mc(27421.27,tolb)}
R27 N002 N001 {mc(27421.27,tola)}
R28 Voute N004 {mc(27421.27,tola)}
C11 N002 N005 {mc(27421.27,tolb)}
R29 N001 N008 {mc(27421.27,tola)}
R30 N004 N008 {mc(27421.27,tola)}
R31 N005 N008 {mc(27421.27,tola)}
XU13 N024 NC_02 +Vcc -Vcc N024 TL082  ; pins In+ In- V+ V- OUT
XU14 N017 NC_03 +Vcc -Vcc N017 TL082  ; pins In+ In- V+ V- OUT
XU15 N011 NC_04 +Vcc -Vcc N011 TL082  ; pins In+ In- V+ V- OUT
XU16 VinBuff N031 +Vcc -Vcc VinBuff TL082  ; pins In+ In- V+ V- OUT
.lib TL082.301
.ac dec 1E3 100 1E6
.param tola=0.01
.step param run 1 100 1
;tran 0 1 0 0.000001
.param tolb=0.05
* SEDRA HPN
* SEDRA LPN
* Fleischer-Tow 1
* Fleischer-Tow 2
* Fleischer-Tow 3
* BUFFER 2
* BUFFER 3
* BUFFER 4
* BUFFER 5
* BUFFER 2
* Generador
* Alimentacion
.lib UniversalOpamps2.sub
.backanno
.end